# EasyEDA Pro project VCF-1u.eprj

# Board Bottom
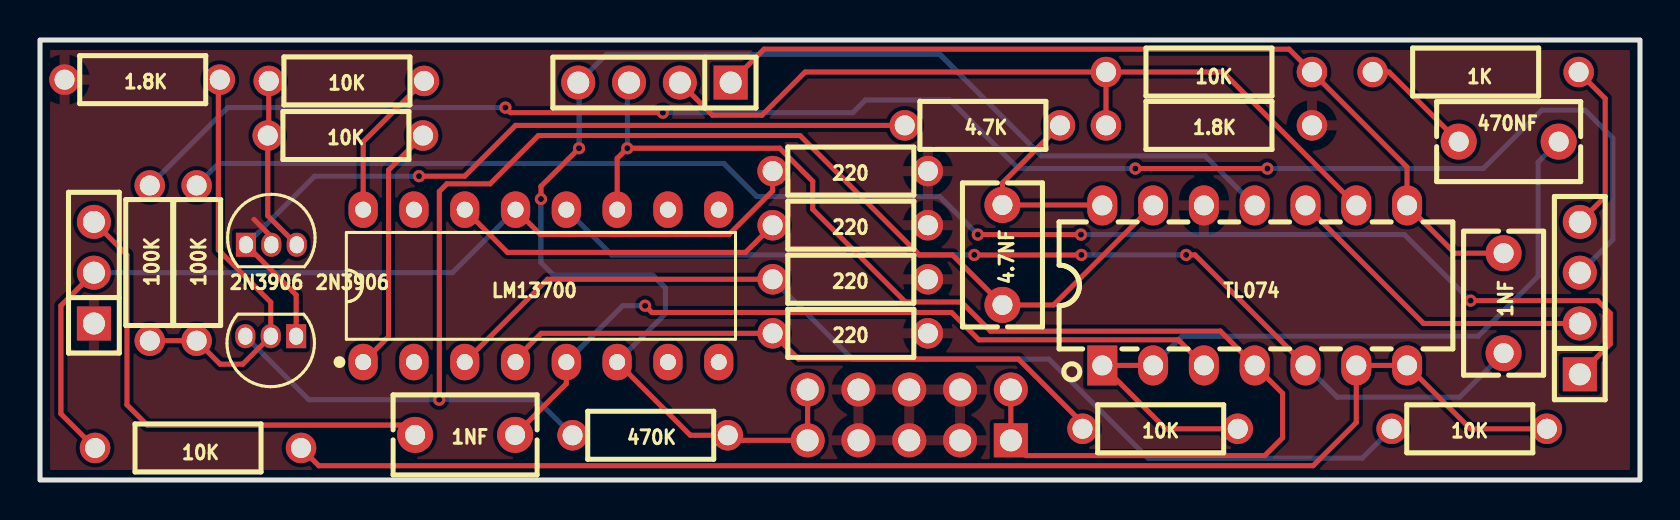
[diagram p0: board, top side]
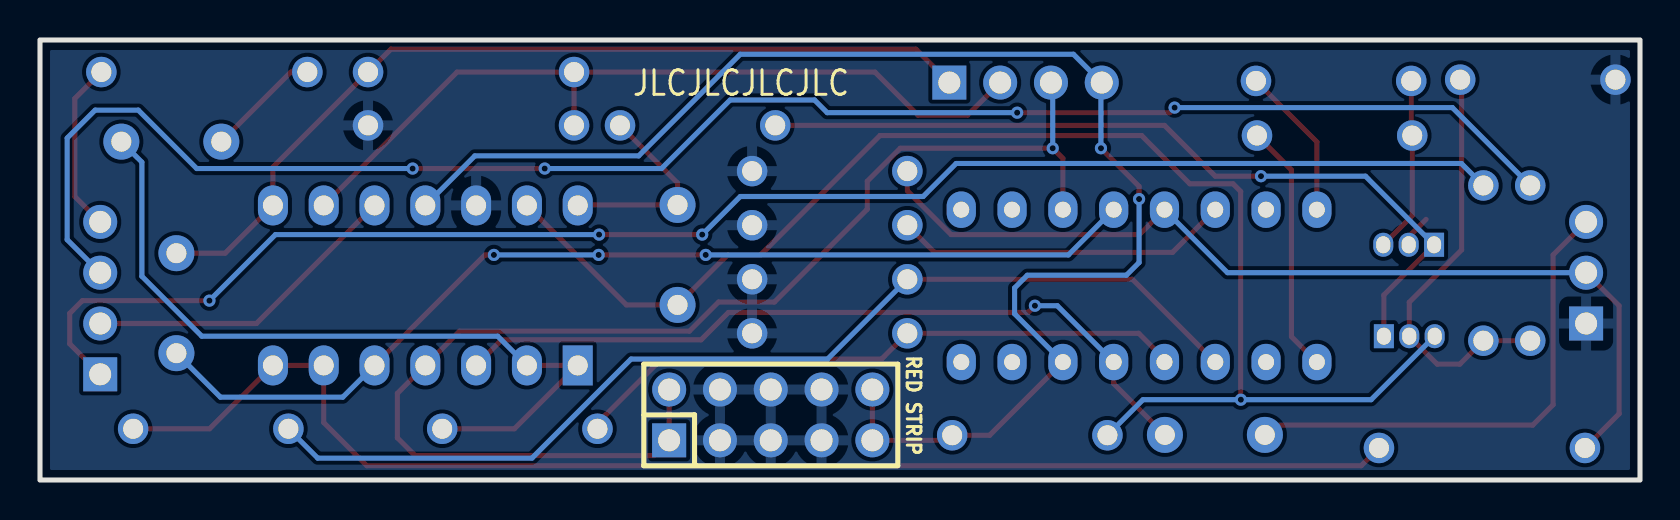
[diagram p1: board, bottom side, seen from below]

Outline 80 x 22 mm; copper layers: Top Layer, Inner1, Inner2, Inner3, Inner4, Inner5, Inner6, Inner7, Inner8, Inner9, Inner10, Inner11, Inner12, Inner13, Inner14, Inner15, Inner16, Inner17, Inner18, Inner19, Inner20, Inner21, Inner22, Inner23, Inner24, Inner25, Inner26, Inner27, Inner28, Inner29, Inner30, Bottom Layer. Coordinates in mm from the lower left corner of the outline.
Outline path: rectangle 0,22 80,0
Stack: Top Layer 0.035mm / Dielectric1 1.51mm FR4 er 4.5 / Bottom Layer 0.035mm

## Design rules (mm)
template: JLCPCB Capability(Two Layers Board)
spacing copperThickness1oz (default): track to track 0.102, other pairs 0.152 to 0.3
spacing copperThickness2oz: track to track 0.203, other pairs 0.152 to 0.3
track width copperThickness1oz (default): min 0.127, default 0.254, max 2.54
track width copperThickness2oz: min 0.203, default 0.254, max 2.54
differential pair differentialPair (default): width min 0.127, default 0.254, max 2.54; gap min 0.152, default 0.152
via viaSize (default): diameter min 0.5, default 0.61, max 10; hole min 0.3, default 0.305, max 6.3

## Placement (name value [footprint] x y rotation side)
1.8K  -  [RES-TH_BD2.4-L6.3-P10.30-D0.6]  5.14 20.02 0 top
1.8K#2  -  [RES-TH_BD2.4-L6.3-P10.30-D0.6#2]  58.45 17.73 0 top
1K  10kΩ  [RES-TH_BD2.4-L6.3-P10.30-D0.6#2]  71.78 20.4 0 top
1NF  -  [CAP-TH_L7.2-W4.0-P5.00-D0.5]  73.18 8.84 90 top
1NF#2  -  [CAP-TH_L7.2-W4.0-P5.00-D0.5]  21.26 2.26 0 top
2N3906  -  [TO-92-3_L4.5-W3.5-P1.27-L]  11.54 7.19 180 top
2N3906#2  -  [TO-92-3_L4.5-W3.5-P1.27-L]  11.57 11.76 0 top
4.7K  10kΩ  [RES-TH_BD2.4-L6.3-P10.30-D0.6]  47.14 17.73 0 top
4.7NF  47nF  [CAP-TH_L7.2-W4.0-P5.00-D0.5]  48.12 11.25 90 top
10K  -  [RES-TH_BD2.4-L6.3-P10.30-D0.6]  56.04 2.56 0 top
10K#2  -  [RES-TH_BD2.4-L6.3-P10.30-D0.6]  71.49 2.56 0 top
10K#3  -  [RES-TH_BD2.4-L6.3-P10.30-D0.6]  15.35 19.95 0 top
10K#4  -  [RES-TH_BD2.4-L6.3-P10.30-D0.6]  15.3 17.22 0 top
10K#5  -  [RES-TH_BD2.4-L6.3-P10.30-D0.6#2]  58.45 20.4 0 top
10K#6  -  [RES-TH_BD2.4-L6.3-P10.30-D0.6#2]  7.9 1.6 0 top
100K  -  [RES-TH_BD2.4-L6.3-P10.30-D0.6]  5.49 10.87 90 top
100K#2  -  [RES-TH_BD2.4-L6.3-P10.30-D0.6]  7.83 10.87 90 top
220  -  [RES-TH_BD2.4-L6.3-P10.30-D0.6]  40.54 15.45 0 top
220#2  -  [RES-TH_BD2.4-L6.3-P10.30-D0.6]  40.54 12.74 0 top
220#3  -  [RES-TH_BD2.4-L6.3-P10.30-D0.6]  40.54 10.04 0 top
220#4  -  [RES-TH_BD2.4-L6.3-P10.30-D0.6]  40.54 7.33 0 top
470K  10kΩ  [RES-TH_BD2.4-L6.3-P10.30-D0.6]  30.54 2.24 0 top
470NF  47nF  [CAP-TH_L7.2-W4.0-P5.00-D0.5]  73.43 16.92 0 top
H1  PZ254V-11-03P  [HDR-TH_3P-P2.54-V-M]  2.7 10.37 90 top
H2  -  [HDR-TH_4P-P2.54-V-M]  30.72 19.87 180 top
H2#2  -  [HDR-TH_4P-P2.54-V-M]  76.99 9.1 90 top
LM13700  LM13700AN  [DIP-16_L19.3-W6.4-P2.54-LS7.6-BL]  25.05 9.71 0 top
RED STRIP  ZX-PZ2.54-2-5PZZ  [HDR-TH_10P-P2.54-V-M-R2-C5-S2.54]  43.46 3.25 180 bottom
TL074  TL074CN  [PDIP-14_L19.7-W6.6-P2.54-LS8.3-BL]  60.73 9.73 0 top

## Footprints (pads in the part's own frame, mm; a bottom-side part is the same pattern mirrored in y, then rotated)
CAP-TH_L7.2-W4.0-P5.00-D0.5
  round 1.8 hole 1: 1(-2.499,0) 2(2.499,0)
DIP-16_L19.3-W6.4-P2.54-LS7.6-BL
  oval 1.46x1.825 hole 0.8: 1(-8.89,-3.81) 2(-6.35,-3.81) 3(-3.81,-3.81) 4(-1.27,-3.81) 5(1.27,-3.81) 6(3.81,-3.81) 7(6.35,-3.81) 8(8.89,-3.81) 9(8.89,3.81) 10(6.35,3.81) 11(3.81,3.81) 12(1.27,3.81) 13(-1.27,3.81) 14(-3.81,3.81) 15(-6.35,3.81) 16(-8.89,3.81)
HDR-TH_3P-P2.54-V-M
  rect 1.7x1.7 hole 1.1: 1(-2.54,0)
  round 1.7 hole 1.1: 2(0,0) 3(2.54,0)
HDR-TH_4P-P2.54-V-M
  rect 1.7x1.7 hole 1.1: 1(-3.81,0)
  round 1.7 hole 1.1: 2(-1.27,0) 3(1.27,0) 4(3.81,0)
HDR-TH_10P-P2.54-V-M-R2-C5-S2.54
  rect 1.7x1.7 hole 1.1: 1(-5.08,-1.27)
  round 1.7 hole 1.1: 2(-5.08,1.27) 3(-2.54,-1.27) 4(-2.54,1.27) 5(0,-1.27) 6(0,1.27) 7(2.54,-1.27) 8(2.54,1.27) 9(5.08,-1.27) 10(5.08,1.27)
PDIP-14_L19.7-W6.6-P2.54-LS8.3-BL
  rect 1.5x2 hole 1: 1(-7.62,-4)
  oval 1.5x2 hole 1: 2(-5.08,-4) 3(-2.54,-4) 4(0,-4) 5(2.54,-4) 6(5.08,-4) 7(7.62,-4) 8(7.62,4) 9(5.08,4) 10(2.54,4) 11(0,4) 12(-2.54,4) 13(-5.08,4) 14(-7.62,4)
RES-TH_BD2.4-L6.3-P10.30-D0.6
  round 1.524 hole 1: 1(-3.908,0) 2(3.854,0)
RES-TH_BD2.4-L6.3-P10.30-D0.6#2
  round 1.524 hole 1: 1(-5.15,0) 2(5.15,0)
TO-92-3_L4.5-W3.5-P1.27-L
  rect 1x1.2 hole 0.7x0.85: 1(-1.27,0)
  oval 1x1.2 hole 0.7x0.85: 2(0,0) 3(1.27,0)

## Nets
GND: 1.8K.1 1.8K#2.2 2N3906#2.2 220.2 220#2.2 220#3.2 220#4.2 H1.1 RED STRIP.3 RED STRIP.4 RED STRIP.5 RED STRIP.6 RED STRIP.7 RED STRIP.8 TL074.12
3: 10K#2.1 220#3.1 LM13700.3
4: 10K.1 220#4.1 LM13700.4
14: 220#2.1 LM13700.14
+12: H2.3 LM13700.11 RED STRIP.1 RED STRIP.2 TL074.4
-12: 470K.2 H2.4 LM13700.6 RED STRIP.9 RED STRIP.10 TL074.11
CUTOFF: 100K#2.2 H2#2.1
CV: 100K.2 H2#2.3
D: 1NF#2.2 LM13700.5 TL074.3
E: 1NF.1 LM13700.12 TL074.5
G: 2N3906.1 2N3906#2.1 4.7K.1
G_RES: 4.7K.2 4.7NF.2 TL074.14
H: 2N3906.3 4.7NF.1 470K.1 TL074.13
HP_IN: 1NF#2.1 H1.3
L1: 1.8K#2.1 10K#5.1 H2.2 TL074.9
L2: 1NF.2 10K#5.2 H2.1 TL074.8
LP: 10K#6.1 220.1 H1.2 LM13700.13
OUT: 1K.2 H2#2.4
OUT_CAP: 10K.2 470NF.2 TL074.1 TL074.2
OUT_RES: 1K.1 470NF.1
RES: H2#2.2 TL074.10

Pads without a net: 1.8K 2; 2N3906 2; 2N3906#2 3; 10K#2 2; 10K#3 1 2; 10K#4 1 2; 10K#6 2; 100K 1; 100K#2 1; LM13700 1 2 7 8 9 10 15 16; TL074 6 7

## Via types
v1: diameter 0.61, hole 0.305, Top Layer to Bottom Layer, 16 vias

## Routing (per net, layer and track width the routed paths; a pad name or vN(x,y) marks a point on that pad's centre or on a via; arc(x,y) is an arc through that point)
GND: length 1.6
  Top Layer w0.254: 2N3906#2.2 11.57,12.16 10.7,13.03
(no net): length 117.9
  Top Layer w0.254: LM13700.1 17.43,7.17 17.43,15.5 10K#4.2 ; 1.8K.2 8.92,19.94 8.92,11.51 11.54,8.89 2N3906.2 10.14,5.79 9,5.79 100K#2.1 100K.1 ; 2N3906#2.3 11.39,13.21 10K#4.1 11.44,17.27 10K#3.1 ; LM13700.16 16.16,16.91 10K#3.2 ; 10K#2.2 71.52,2.56 TL074.7 TL074.6 65.81,2.87 63.66,0.71 13.94,0.71 10K#6.2
3: length 52.4
  Top Layer w0.254: 36.63,10.04 25.38,10.04 LM13700.3
  Bottom Layer w0.254: 36.63,10.04 40.62,6.05 50.45,6.05 55.4,1.09 66.11,1.09 67.58,2.56
4: length 31.2
  Top Layer w0.254: 10K.1 52.13,2.84 48.92,6.05 37.92,6.05 36.63,7.33 25.06,7.33 23.78,6.05 LM13700.4
14: length 16.8
  Top Layer w0.254: LM13700.14 23.37,11.38 35.28,11.38 36.63,12.74
+12: length 64.3
  Top Layer w0.254: LM13700.11 28.86,16.08 v1(29.36,16.59) 36.98,16.59 38.64,14.94 38.64,13.54 43.28,8.9 46.07,8.9 47.53,7.44 59.02,7.44 TL074.4 62.13,4.33 62.13,2.11 61.24,1.22 49.3,1.22 RED STRIP.1 RED STRIP.2
  Bottom Layer w0.254: v1(29.36,16.59) 29.36,19.78 H2.3
-12: length 72.5
  Top Layer w0.254: 26.95,19.83 H2.4 ; v1(26.95,16.59) 25.05,14.68 v1(25.05,14.05) ; LM13700.6 32.52,2.24 470K.2 34.64,1.98 RED STRIP.9 RED STRIP.10
  Bottom Layer w0.254: LM13700.6 31.27,8.31 31.27,9.6 30.64,10.24 25.68,10.24 25.05,10.87 v1(25.05,14.05) ; v1(26.95,16.59) 26.95,19.83 H2.4 28.33,21.29 44.99,21.29 50.07,16.21 58.26,16.21 TL074.11
CUTOFF: length 77.9
  Top Layer w0.254: v1(46.89,12.27) v1(52.05,12.27) ; H2#2.1 78.51,6.81 78.51,8.33 77.88,8.97 v1(71.53,8.97)
  Bottom Layer w0.254: v1(71.53,8.97) 68.23,12.27 v1(52.05,12.27) ; 100K#2.2 8.93,15.83 34.19,15.83 35.84,14.18 44.99,14.18 v1(46.89,12.27)
CV: length 85.8
  Top Layer w0.254: v1(31.14,18.37) 23.52,18.37 v1(23.27,18.62) ; v1(54.77,15.57) v1(61.37,15.57)
  Bottom Layer w0.254: v1(54.77,15.57) 48.92,15.57 45.49,19 41.27,19 40.64,18.37 v1(31.14,18.37) ; v1(23.27,18.62) 9.38,18.62 100K.2 ; H2#2.3 78.64,12.02 78.64,17.1 77.24,18.49 75.08,18.49 72.16,15.57 v1(61.37,15.57)
D: length 39
  Top Layer w0.254: TL074.3 56.91,7.01 46.95,7.01 45.58,8.38 30.59,8.38 v1(30.25,8.71) ; 1NF#2.2 26.32,4.82 26.32,5.9
  Bottom Layer w0.254: 26.32,5.9 29.13,8.71 v1(30.25,8.71)
E: length 51.7
  Top Layer w0.254: v1(46.71,11.25) v1(52.07,11.25) ; v1(57.3,11.25) 57.75,11.25 TL074.5
  Bottom Layer w0.254: TL074.5 64.86,4.14 70.98,4.14 1NF.1 ; v1(52.07,11.25) v1(57.3,11.25) ; 26.32,13.52 28.58,11.25 v1(46.71,11.25)
G: length 41
  Top Layer w0.254: v1(18.95,15.19) 21.24,15.19 23.78,17.73 4.7K.1 ; 2N3906.1 12.81,9.25 2N3906#2.1
  Bottom Layer w0.254: v1(18.95,15.19) 13.73,15.19 2N3906#2.1
G_RES: length 10.2
  Top Layer w0.254: 4.7K.2 48.12,14.86 4.7NF.2 53.09,13.75 TL074.14
H: length 71.2
  Top Layer w0.254: TL074.13 50.68,8.75 4.7NF.1 45.62,11.25 43.97,11.25 38,17.22 24.92,17.22 22.51,14.81 20.35,14.81 19.97,14.43 19.97,4.02 v1(19.96,4.02)
  Bottom Layer w0.254: 2N3906.3 13.44,4.02 v1(19.96,4.02) 24.85,4.02 470K.1
HP_IN: length 24.9
  Top Layer w0.254: 1NF#2.1 18.27,2.75 5.36,2.75 4.35,3.76 4.35,11.25 H1.3
L1: length 40.8
  Top Layer w0.254: 10K#5.1 38.26,20.4 36.1,18.24 33.63,18.24 H2.2 ; 10K#5.1 1.8K#2.1 ; 10K#5.1 59.14,20.4 TL074.9
L2: length 44.7
  Top Layer w0.254: H2.1 36.2,21.54 62.45,21.54 10K#5.2 68.35,15.64 TL074.8 70.74,11.34 1NF.2
LP: length 47.8
  Top Layer w0.254: 36.63,15.45 36.63,14.46 34.45,12.27 25.02,12.27 LM13700.13 ; 10K#6.1 1.04,3.31 1.04,8.71 H1.2
  Bottom Layer w0.254: H1.2 20.63,10.37 LM13700.13
OUT: length 8.6
  Top Layer w0.254: 1K.2 78.26,19.07 78.26,14.18 H2#2.4
OUT_CAP: length 38.9
  Top Layer w0.254: TL074.2 TL074.1 56.28,2.56 59.89,2.56
  Bottom Layer w0.254: TL074.2 57.11,7.19 71.91,7.19 74.91,10.19 74.91,15.89 470NF.2
OUT_RES: length 5.7
  Top Layer w0.254: 470NF.1 67.45,20.4 1K.1
RES: length 16.2
  Top Layer w0.254: H2#2.2 69.18,7.83 TL074.10

## Copper pours and planes (outline as drawn; the poured copper is in the pictures)
GND on Top Layer: 0,22 80,22 80,0 0,0
GND on Bottom Layer: 0,22 80,22 80,0 0,0

## Text on the board
Bottom Silkscreen Layer: JLCJLCJLCJLC

# Board Top
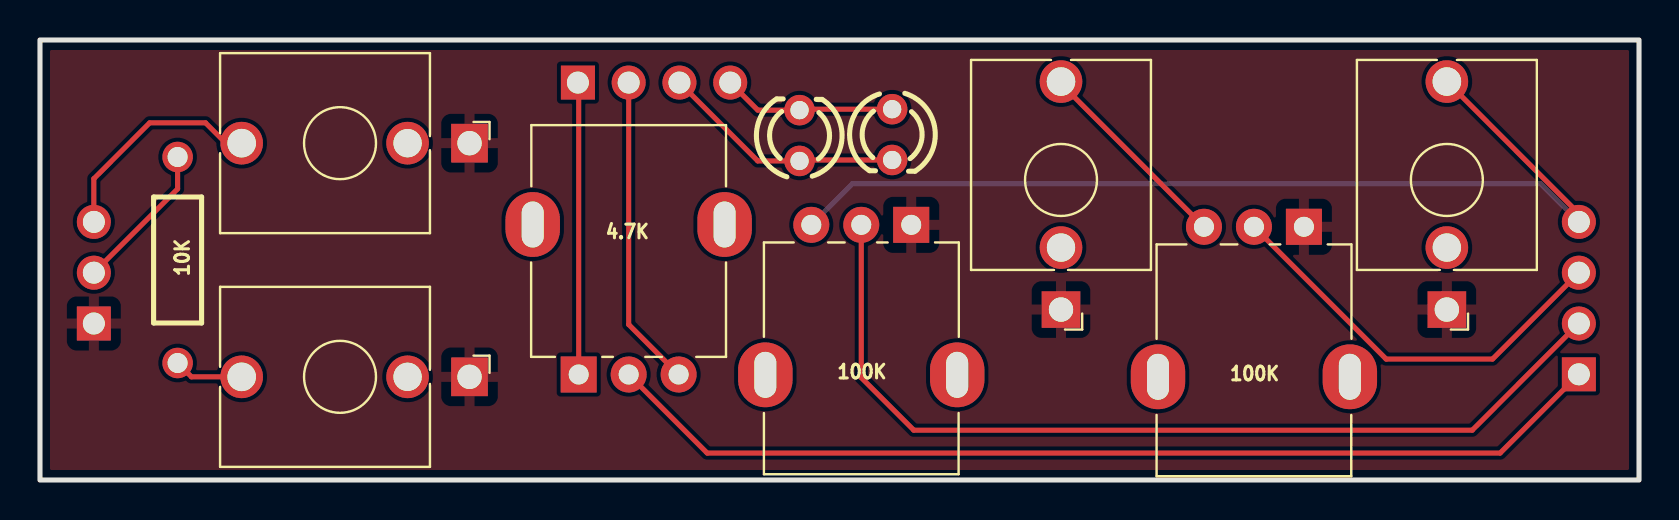
[diagram p2: board, top side]
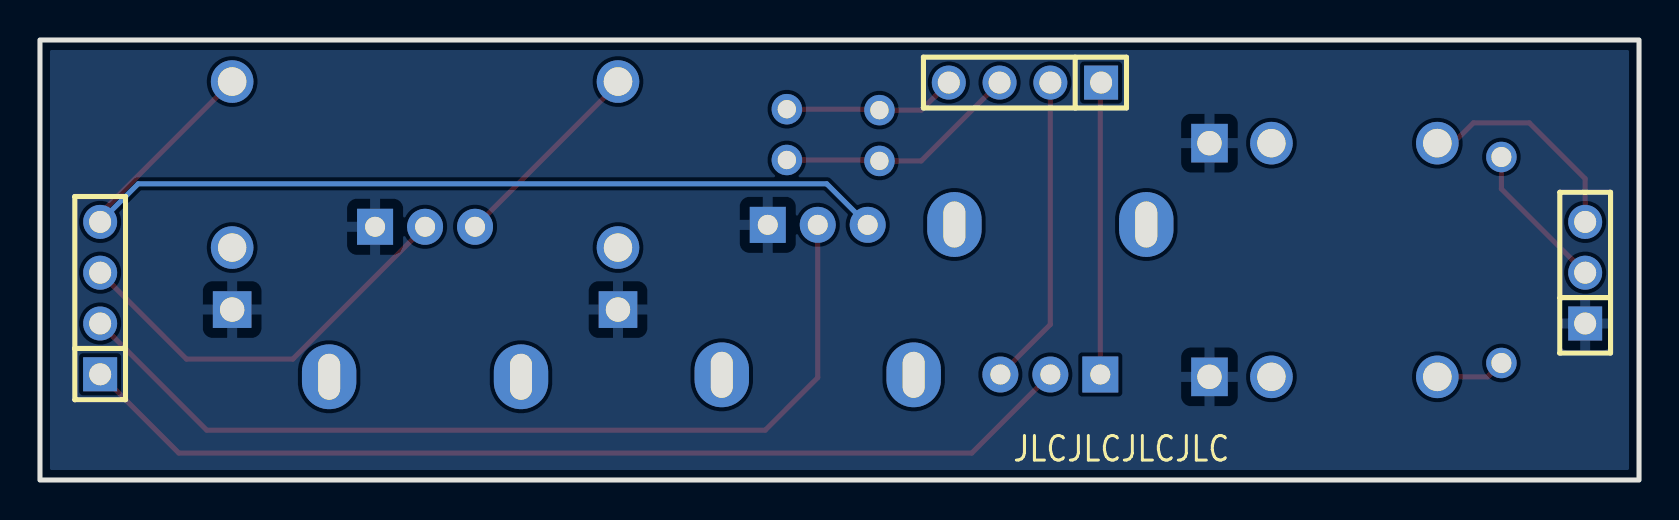
[diagram p3: board, bottom side, seen from below]

Outline 80 x 22 mm; copper layers: Top Layer, Bottom Layer. Coordinates in mm from the lower left corner of the outline.
Outline path: rectangle 0,22 80,0
Stack: Top Layer 0.035mm / Dielectric1 1.51mm FR4 er 4.5 / Bottom Layer 0.035mm

## Design rules (mm)
template: JLCPCB Capability(Two Layers Board)
spacing copperThickness1oz (default): track to track 0.102, other pairs 0.152 to 0.3
spacing copperThickness2oz: track to track 0.203, other pairs 0.152 to 0.3
track width copperThickness1oz (default): min 0.127, default 0.254, max 2.54
track width copperThickness2oz: min 0.203, default 0.254, max 2.54
differential pair differentialPair (default): width min 0.127, default 0.254, max 2.54; gap min 0.152, default 0.152
via viaSize (default): diameter min 0.5, default 0.61, max 10; hole min 0.3, default 0.305, max 6.3

## Placement (name value [footprint] x y rotation side)
4.7K  -  [benjiaomodular:Potentiometer_RV09]  26.95 5.28 90 top
10K  10kΩ  [RES-TH_BD2.4-L6.3-P10.30-D0.6]  6.89 11 90 top
100K  -  [benjiaomodular:Potentiometer_RV09]  43.59 12.76 270 top
100K#2  -  [benjiaomodular:Potentiometer_RV09]  63.23 12.66 270 top
H1  PZ254V-11-03P  [HDR-TH_3P-P2.54-V-M]  2.69 10.37 90 bottom
H2  -  [HDR-TH_4P-P2.54-V-M]  30.72 19.87 0 bottom
H2#2  -  [HDR-TH_4P-P2.54-V-M]  76.99 9.1 90 bottom
J1  -  [benjiaomodular:AudioJack_3.5mm]  21.49 5.16 270 top
J1#2  -  [benjiaomodular:AudioJack_3.5mm]  21.49 16.84 270 top
J1#3  -  [benjiaomodular:AudioJack_3.5mm]  70.39 8.52 180 top
J1#4  -  [benjiaomodular:AudioJack_3.5mm]  51.08 8.52 180 top
LED1  204-10SURD/S530-A3-L  [LED-TH_BD3.0-P2.54-FD]  38 17.22 90 top
LED2  204-10SURD/S530-A3-L  [LED-TH_BD3.0-P2.54-FD]  42.63 17.27 270 top

## Footprints (pads in the part's own frame, mm; a bottom-side part is the same pattern mirrored in y, then rotated)
benjiaomodular:AudioJack_3.5mm
  rect 1.93x1.83 hole 1.22: S(0,0)
  round 2.13 hole 1.43: T(0,-11.4)
  round 2.13 hole 1.42: TN(0,-3.1)
benjiaomodular:Potentiometer_RV09
  rect 1.8x1.8 hole 1: 1(0,0)
  round 1.8 hole 1: 2(0,-2.5) 3(0,-5)
  oval 3.24x2.72 hole 2.3x1.1: 4(7.5,-7.3) 5(7.5,2.3)
HDR-TH_3P-P2.54-V-M
  rect 1.7x1.7 hole 1.1: 1(-2.54,0)
  round 1.7 hole 1.1: 2(0,0) 3(2.54,0)
HDR-TH_4P-P2.54-V-M
  rect 1.7x1.7 hole 1.1: 1(-3.81,0)
  round 1.7 hole 1.1: 2(-1.27,0) 3(1.27,0) 4(3.81,0)
LED-TH_BD3.0-P2.54-FD
  round 1.524 hole 0.914: 1(-1.27,0) 2(1.27,0)
RES-TH_BD2.4-L6.3-P10.30-D0.6
  round 1.524 hole 1: 1(-5.15,0) 2(5.15,0)

## Nets
GND: 100K.1 100K#2.1 H1.1 J1.S J1#2.S J1#3.S J1#4.S
+12: 4.7K.3 H2.2
-12: 4.7K.1 H2.1
CUTOFF: 4.7K.2 H2#2.1
CV: 100K#2.2 H2#2.3
CV_IN: 100K#2.3 J1#4.T
HP_IN: H1.3 J1#2.T
L1: H2.3 LED1.1 LED2.2
L2: H2.4 LED1.2 LED2.1
LP: 10K.2 H1.2
LP_IN: 10K.1 J1.T
OUT: 100K.3 H2#2.4 J1#3.T
RES: 100K.2 H2#2.2

Pads without a net: 4.7K 4 5; 100K 4 5; 100K#2 4 5; J1 TN; J1#2 TN; J1#3 TN; J1#4 TN

## Routing (per net, layer and track width the routed paths; a pad name or vN(x,y) marks a point on that pad's centre or on a via; arc(x,y) is an arc through that point)
+12: length 15.6
  Top Layer w0.254: 4.7K.3 29.45,7.77 H2.2
-12: length 14.6
  Top Layer w0.254: 4.7K.1 26.95,19.83 H2.1
CUTOFF: length 50.8
  Top Layer w0.254: 4.7K.2 33.38,1.35 73.05,1.35 H2#2.1
CV: length 20.8
  Top Layer w0.254: H2#2.3 72.67,6.05 67.35,6.05 100K#2.2
CV_IN: length 10.2
  Top Layer w0.254: J1#4.T 51.08,19.81 100K#2.3
HP_IN: length 11.1
  Top Layer w0.254: J1#2.T 9.3,16.84 8.28,17.86 5.49,17.86 2.69,15.06 H1.3
L1: length 12.3
  Top Layer w0.254: LED2.2 38.05,16 LED1.1 35.91,15.95 H2.3
L2: length 8.7
  Top Layer w0.254: LED2.1 38.05,18.54 LED1.2 35.91,18.49 H2.4
LP: length 7.5
  Top Layer w0.254: H1.2 6.89,14.56 10K.2
LP_IN: length 3.5
  Top Layer w0.254: 10K.1 7.58,5.16 J1.T
OUT: length 49.8
  Top Layer w0.254: H2#2.4 76.99,13.32 J1#3.T
  Bottom Layer w0.254: H2#2.4 75.08,14.81 40.64,14.81 100K.3
RES: length 46.8
  Top Layer w0.254: H2#2.2 71.66,2.49 43.72,2.49 41.09,5.12 100K.2

## Copper pours and planes (outline as drawn; the poured copper is in the pictures)
GND on Top Layer: 0,22 80,22 80,0 0,0
GND on Bottom Layer: 0.01,22 80.01,22 80.01,0 0.01,0

## Text on the board
Bottom Silkscreen Layer: JLCJLCJLCJLC

# Board Panel
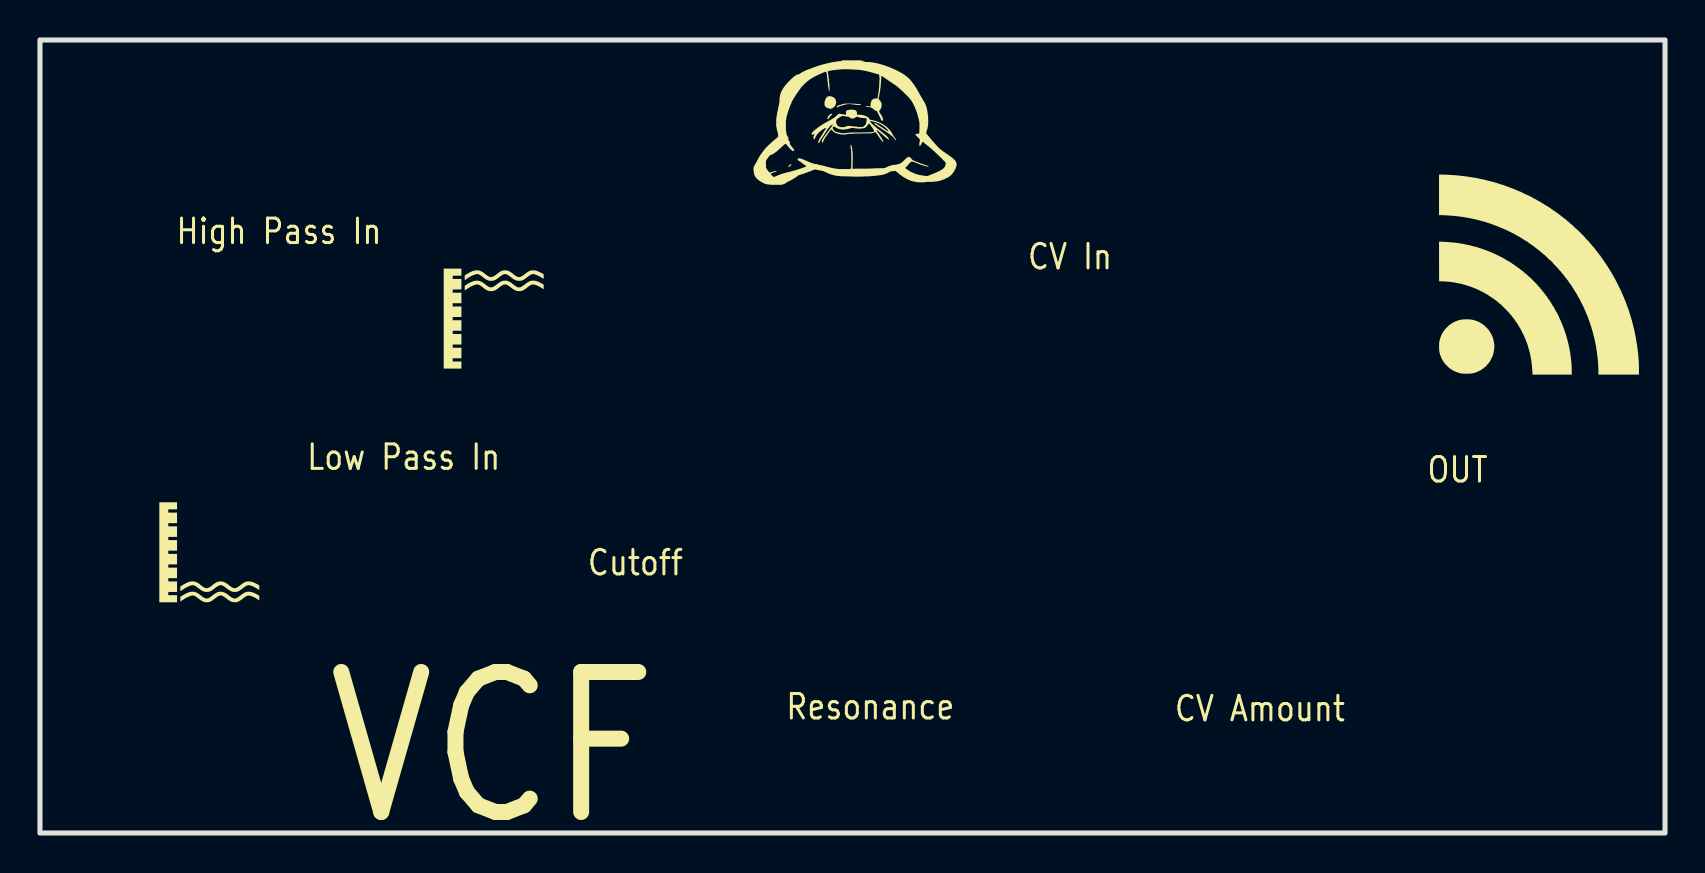
[diagram p4: board, top side]
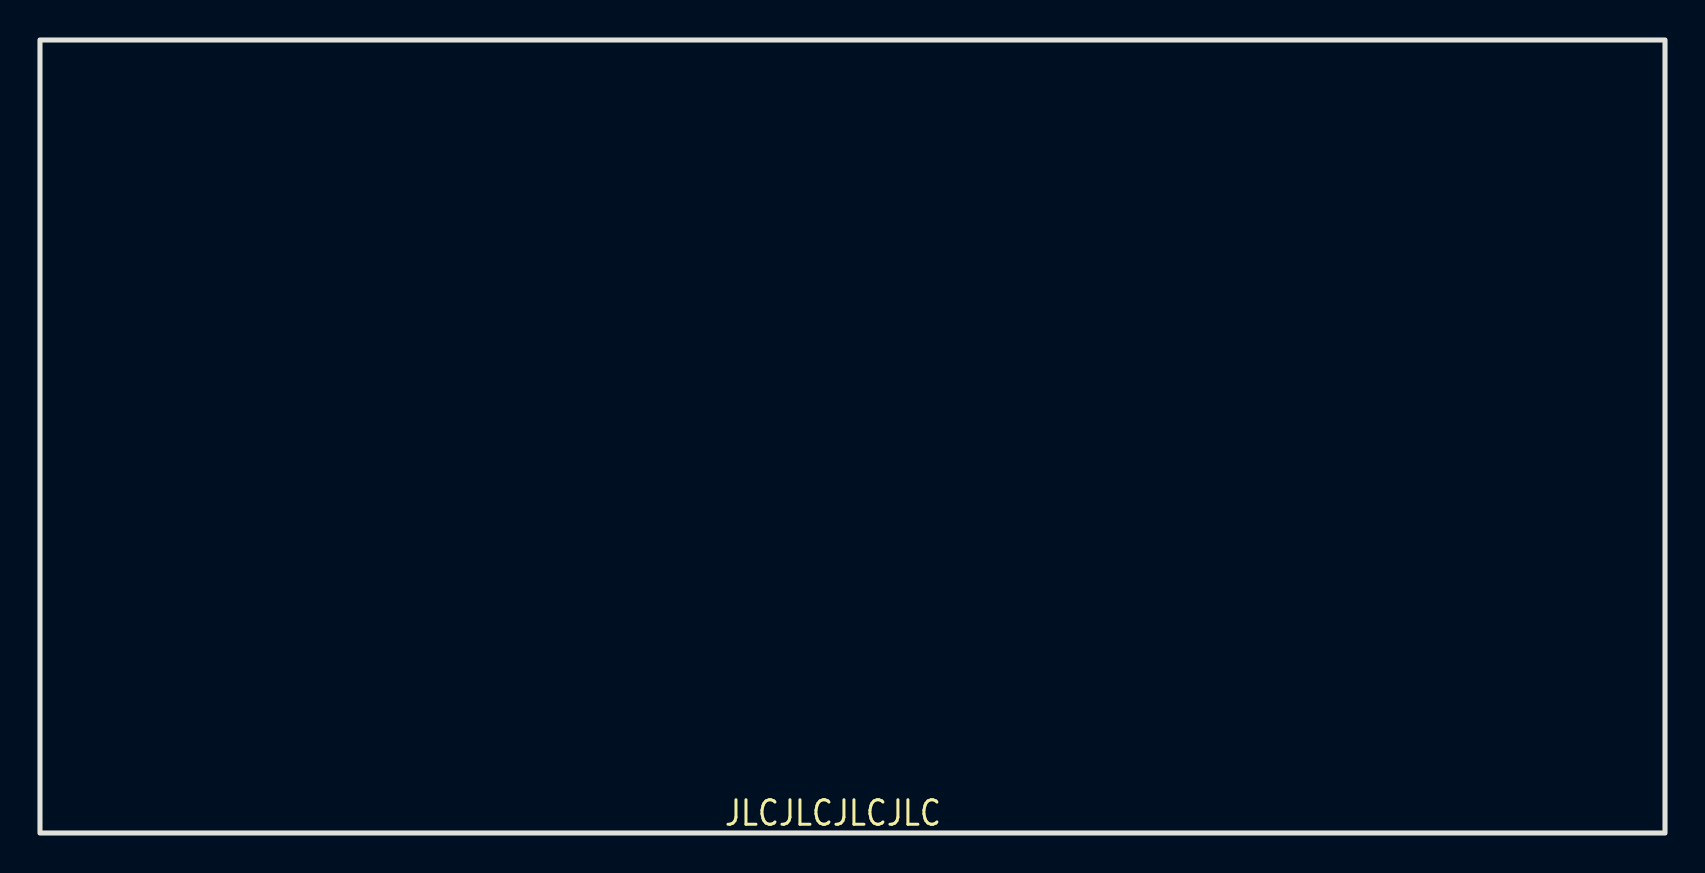
[diagram p5: board, bottom side, seen from below]

Outline 81.28 x 39.65 mm; copper layers: Top Layer, Bottom Layer. Coordinates in mm from the lower left corner of the outline.
Outline path: rectangle 0,39.65 81.28,0
Stack: Top Layer 0.035mm / Dielectric1 1.51mm FR4 er 4.5 / Bottom Layer 0.035mm

## Design rules (mm)
template: JLCPCB Capability(Two Layers Board)
spacing copperThickness1oz (default): track to track 0.102, other pairs 0.152 to 0.3
spacing copperThickness2oz: track to track 0.203, other pairs 0.152 to 0.3
track width copperThickness1oz (default): min 0.127, default 0.254, max 2.54
track width copperThickness2oz: min 0.203, default 0.254, max 2.54
differential pair differentialPair (default): width min 0.127, default 0.254, max 2.54; gap min 0.152, default 0.152
via viaSize (default): diameter min 0.5, default 0.61, max 10; hole min 0.3, default 0.305, max 6.3

## Placement (name value [footprint] x y rotation side)

## Nets

## Text on the board
Bottom Silkscreen Layer: JLCJLCJLCJLC
Top Silkscreen Layer: High Pass In | Low Pass In | Cutoff | Resonance | CV In | CV Amount | OUT | VCF
